# EAGLE design caricabatteria per moto (EAGLE 4.14)
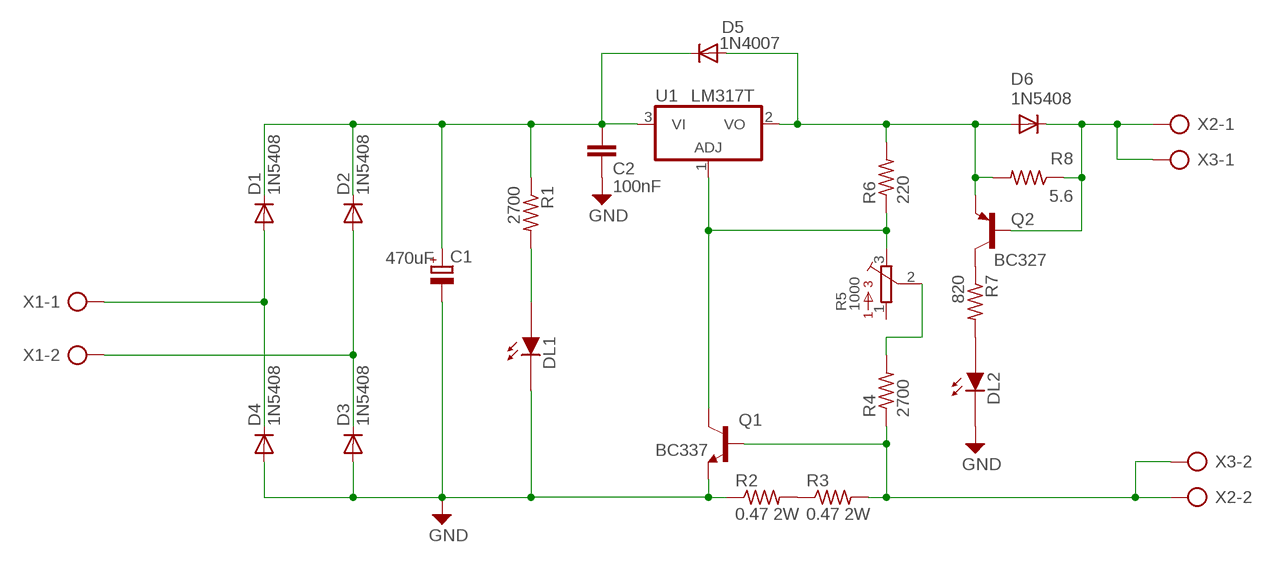
[diagram p0: schematic, sheet 1]

## Parts
C1  470uF  CPOL-EUE5-10.5  [E5-10,5]
C2  100nF  C5/2.5  [C5B2.5]
D1  1N5408  1N5400  [DO201-15]
D2  1N5408  1N5400  [DO201-15]
D3  1N5408  1N5400  [DO201-15]
D4  1N5408  1N5400  [DO201-15]
D5  1N4007  1N5400  [DO201-15]
D6  1N5408  1N5400  [DO201-15]
DL1  LEDF  [R_V526-0]
DL2  LEDF  [R_V526-0]
Q1  BC337  [TO92]
Q2  BC327  [TO92]
R1  2700  R-US_0207/15  [0207/15]
R2  0.47 2W  R-US_0817/22  [P0817/22]
R3  0.47 2W  R-US_0817/22  [P0817/22]
R4  2700  R-US_0207/15  [0207/15]
R5  1000  3386-G  [3386G]
R6  220  R-US_0207/15  [0207/15]
R7  820  R-US_0207/15  [0207/15]
R8  5.6  R-US_0207/15  [0207/15]
U1  LM317T  317T  [TO220H]
X1  AK500/2  [AK500/2]
X2  AK500/2  [AK500/2]
X3  AK500/2  [AK500/2]

## Nets
GND: C1.- C2.2 D3.A D4.A DL1.2(D_OUT) DL2.2(D_OUT) Q1.1(E) R2.1
N$1: R4.2 R5.2
N$2: DL1.1(D_IN) R1.2
N$3: R2.2 R3.1
N$4: C1.+ C2.1 D1.C D2.C D5.C R1.1 U1.3(VI)
N$5: D1.A D4.C X1.1
N$6: Q1.3(C) R5.3 R6.1 U1.1(ADJ)
N$7: D2.A D3.C X1.2
N$8: DL2.1(D_IN) R7.2
N$9: Q1.2(B) R3.2 R4.1 X2.2 X3.2
N$10: Q2.3(C) R7.1
N$11: D6.C Q2.2(B) R8.1 X2.1 X3.1
N$14: D5.A D6.A Q2.1(E) R6.2 R8.2 U1.2(VO)
Unconnected: R5.1

## Library data of the parts
C1 = rcl:CPOL-EU: POLARIZED CAPACITOR, European symbol
C2 = capacitor-wima:C: CAPACITOR naming: grid - package width
D1-D6 = diode:1N5400: DIODE standard rectifier, 3 A, 50 V (Motorola)
DL1 DL2 = m-pad-2.1:LED: LED's in various packages
Q1 = transistor-npn:BC337*: NPN Transistor
Q2 = transistor-pnp:BC327: PNP Transistor
R1-R4 R6-R8 = rcl:R-US_: RESISTOR, American symbol
R5 = BOURNS:3386-: 3386 Series 3/8" Square Trimmer
U1 = linear3:*317: Positive VOLTAGE REGULATOR
X1-X3 = con-ptr500:AK500/2: CONNECTOR

## Board
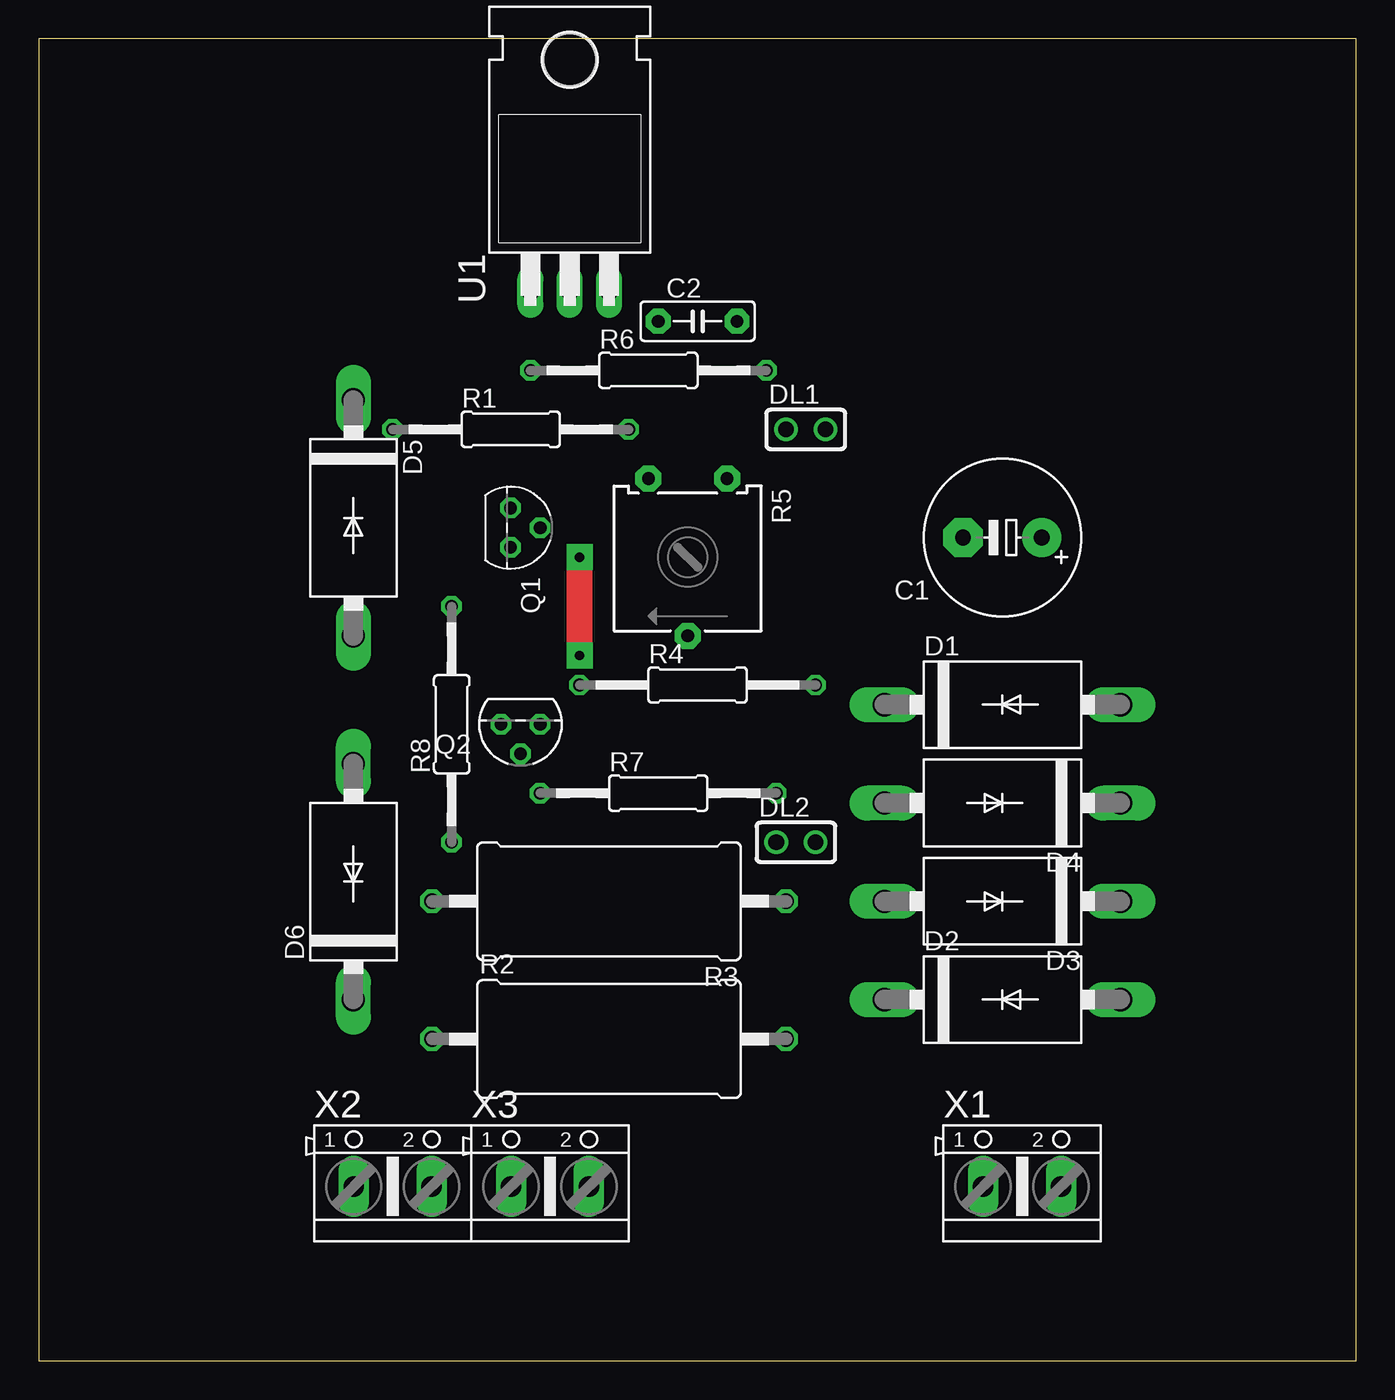
[diagram p1: board, top side]
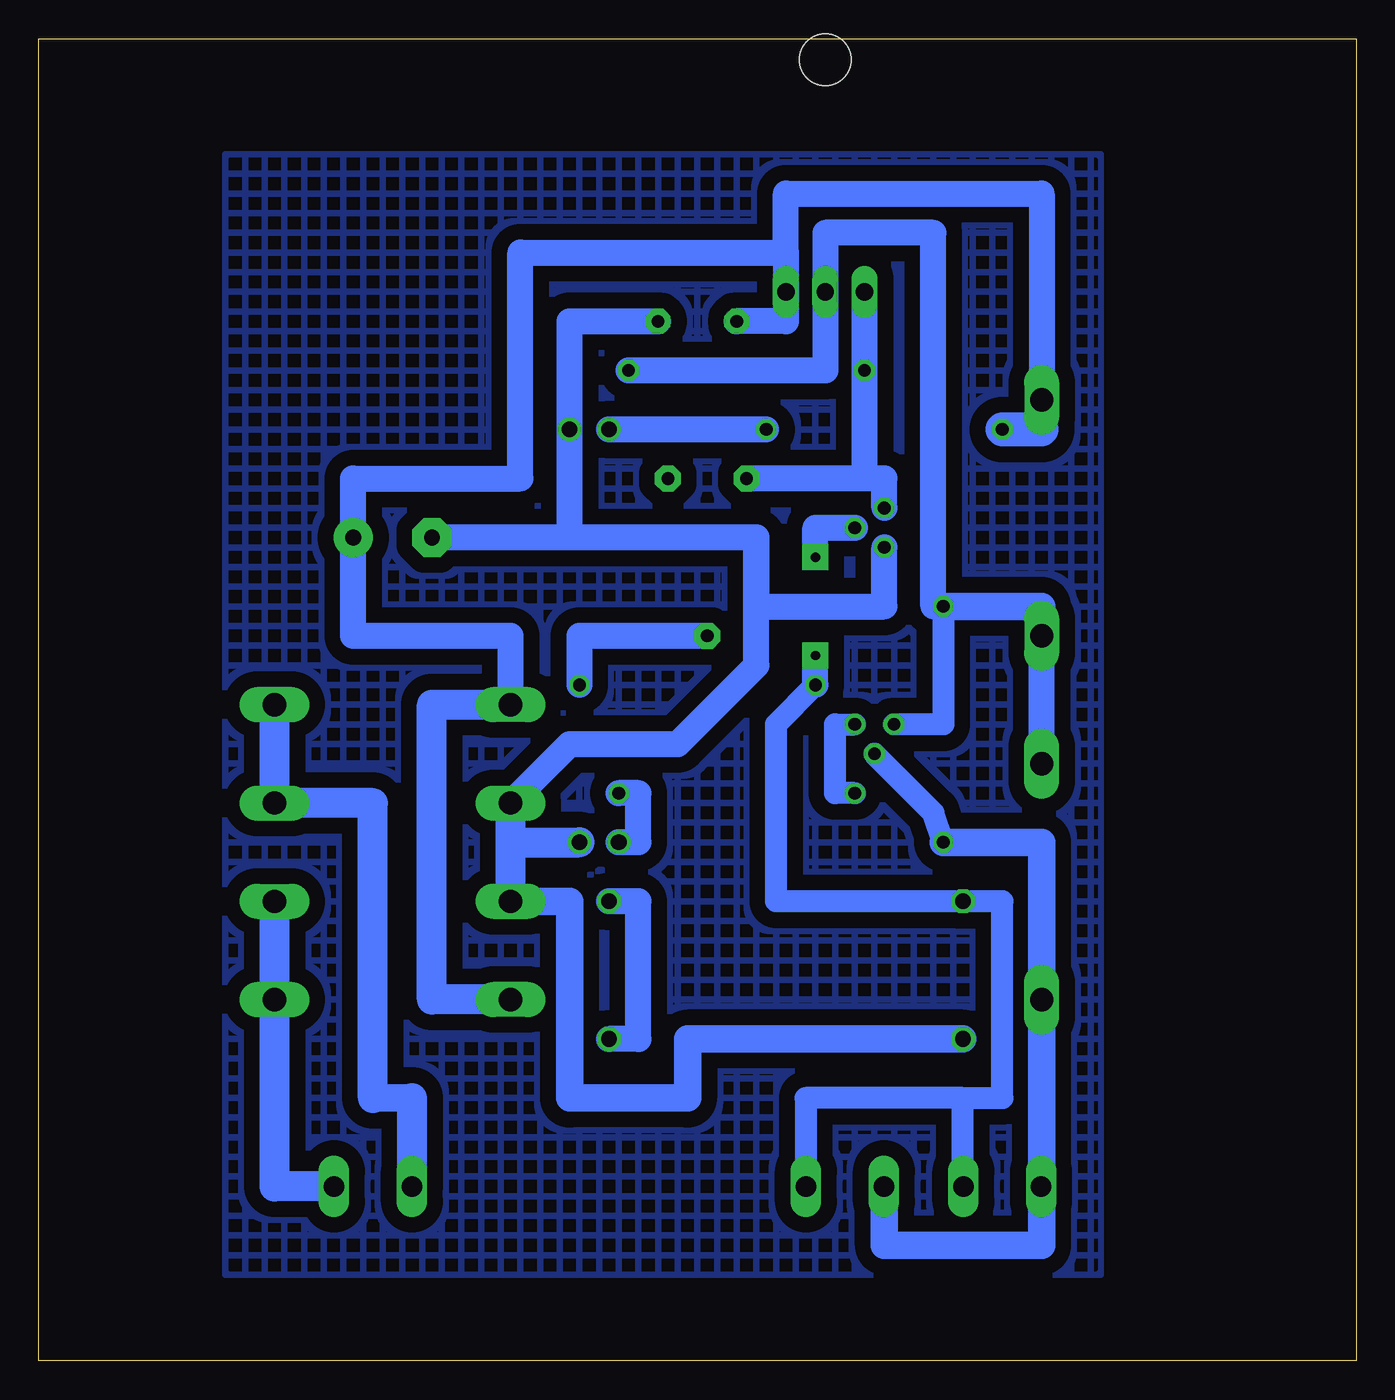
[diagram p2: board, bottom side, seen from below]

Size 85.07 x 85.39 mm. Coordinates in mm from the lower left corner, seen from the top.
Outline: 0,0 85.07,0 85.07,85.39 0,85.39 0,0
Copper layers (1*16): Top 0.035mm / dielectric 1.5mm / Bottom 0.035mm
Design rules "default": minimum track width 30mil, minimum drill 24mil, track to track 8mil, track to pad 8mil, pad to pad 8mil, via to via 8mil, smd to smd 8mil, copper to edge 40mil, drill to drill 8mil, minimum pad ring 10mil, minimum via ring 8mil, stop-mask expansion 4mil, vias tented up to drill 0mil, thermal gap 10mil

### Footprints (pad centres in the part's own frame; a part is rotated, then mirrored left to right if it is on the bottom)
E5-10,5 = drill 1.016 pad 2.54 round: + -2.54,0 | drill 1.016 pad 2.54 octagon: - 2.54,0
C5B2.5 = drill 0.813 pad 1.6 octagon: 1 -2.54,0; 2 2.54,0
DO201-15 = drill 1.499 long: A 7.62,0; C -7.62,0
R_V526-0 = drill 1.016 round: 1 -1.27,0; 2 1.27,0
TO92 = drill 0.813 octagon: 1 1.27,0; 2 0,1.905; 3 -1.27,0
0207/15 = drill 0.813 octagon: 1 -7.62,0; 2 7.62,0
P0817/22 = drill 1.016 octagon: 1 -11.43,0; 2 11.43,0
3386G = drill 0.813 pad 1.676 octagon: 1 -2.54,-5.08; 2 0,5.08; 3 2.54,-5.08
TO220H = drill 1.118 long: 1 -2.54,-10.16; 2 0,-10.16; 3 2.54,-10.16 | hole 3.302: 0,4.826
AK500/2 = drill 1.321 long: 1 -2.515,0; 2 2.515,0

### Placement (x,y rotation side)
C1  62.23,53.18 180 top
C2  42.54,67.14 0 top
D1  62.23,42.38 0 top
D2  62.23,23.33 0 top
D3  62.23,29.68 180 top
D4  62.23,36.03 180 top
D5  20.31,54.45 270 top
D6  20.31,30.95 90 top
DL1  49.52,60.16 0 top
DL2  48.89,33.49 0 top
Q1  30.48,53.81 270 top
Q2  31.11,41.11 180 top
R1  30.48,60.16 0 top
R2  36.83,20.79 0 top
R3  36.83,29.68 180 top
R4  42.54,43.65 0 top
R5  41.91,51.91 180 top
R6  39.37,63.97 0 top
R7  40,36.66 0 top
R8  26.66,41.11 90 top
U1  34.28,79.21 0 top
X1  63.5,11.26 0 top
X2  22.86,11.26 0 top
X3  33.02,11.26 0 top

### Tracks (layer width: path | path; a pad name or v marks a point on that pad's centre or on a via)
GND
  Bottom 0.762: 53.34,29.68 D3.A
  Bottom 1.422: D4.A 53.97,36.03
  Bottom 1.676: 50.8,53.18 DL1.2 50.8,67.14 C2.2 | 38.73,53.18 50.8,53.18 | 38.73,53.18 38.73,49.37 | 38.73,48.73 38.73,44.92 43.81,39.84 50.8,39.84 D4.A | 38.73,48.73 38.73,53.18 | Q1.1 30.48,48.73 38.73,48.73 | 50.8,53.18 C1.-
  Bottom 1.778: R2.1 43.17,20.79 43.17,16.98 50.8,16.98 50.8,29.68 53.34,29.68
  Bottom 1.93: 54.61,33.49 DL2.2 | D3.A 54.61,33.49 | 54.61,33.49 D4.A
N$1
  Bottom 1.676: R5.2 50.16,46.83 R4.2
N$2
  Bottom 1.676: R1.2 DL1.1
N$3
  Bottom 1.676: R3.1 46.35,29.68 46.35,20.79 R2.2
N$4
  Bottom 0.762: D2.C 55.88,23.33
  Bottom 1.676: 36.83,71.59 36.83,75.4 20.31,75.4 D5.C 20.31,60.16 | 36.83,71.59 U1.3 36.83,67.14 C2.1 | D1.C 54.61,46.83 64.77,46.83 C1.+ 64.77,56.99 53.97,56.99 53.97,71.59 36.83,71.59
  Bottom 1.93: D2.C 59.69,23.33 59.69,42.38 D1.C
  Bottom 2.184: 20.31,60.16 R1.1
N$5
  Bottom 1.676: X1.1 60.95,11.26
  Bottom 1.778: 60.95,16.98 63.5,16.98
  Bottom 1.93: D1.A D4.C 63.5,36.03 63.5,16.98 | 60.95,11.26 60.95,16.98
N$6
  Bottom 1.676: 31.74,56.99 R6.1 U1.1 | 31.74,56.99 30.48,56.99 Q1.3 | 31.74,56.99 R5.3
N$7
  Bottom 1.93: X1.2 69.84,11.26 D2.A D3.C
N$8
  Bottom 1.676: DL2.1 46.35,33.49 46.35,36.66 R7.2
N$9  (via drill 0.6 pad 1.68)
  Top 1.676: v34.92,45.55 v34.92,51.91
  Bottom 0.762: 35.55,10.63 X3.2
  Bottom 1.422: 35.55,10.63 35.55,16.98 25.39,16.98 | X2.2 25.39,11.26 25.39,16.98 | 25.39,16.98 22.86,16.98 22.86,29.68 R3.2 37.46,29.68 37.46,41.11 R4.1
  Bottom 1.676: R4.1 v34.92,45.55 | Q1.2 34.92,53.81 v34.92,51.91
N$10
  Bottom 1.422: Q2.3 33.65,41.11 33.65,36.66 R7.1
N$11
  Bottom 1.422: Q2.2 27.3,35.4 R8.1
  Bottom 1.676: X2.1 20.31,11.26
  Bottom 1.778: X2.1 20.31,9.36 20.31,7.46 30.48,7.46 30.48,9.36 X3.1 | R8.1 20.31,33.49 D6.C 20.31,11.26
N$12
  pour Bottom (isolate 1.016, hatched): 16.5,77.94 16.5,5.55 73.02,5.55 73.02,77.94
N$14
  Bottom 1.422: Q2.1 26.66,41.11 R8.2
  Bottom 1.676: D6.A 20.31,48.73 D5.A | R6.2 34.28,63.97 U1.2 34.28,72.86 27.3,72.86 27.3,48.73 R8.2
  Bottom 1.778: 20.31,48.73 R8.2